# Altium schematic sheet BLDC-M8.SCHDOC: AVR-M16 无刷电调
size A4
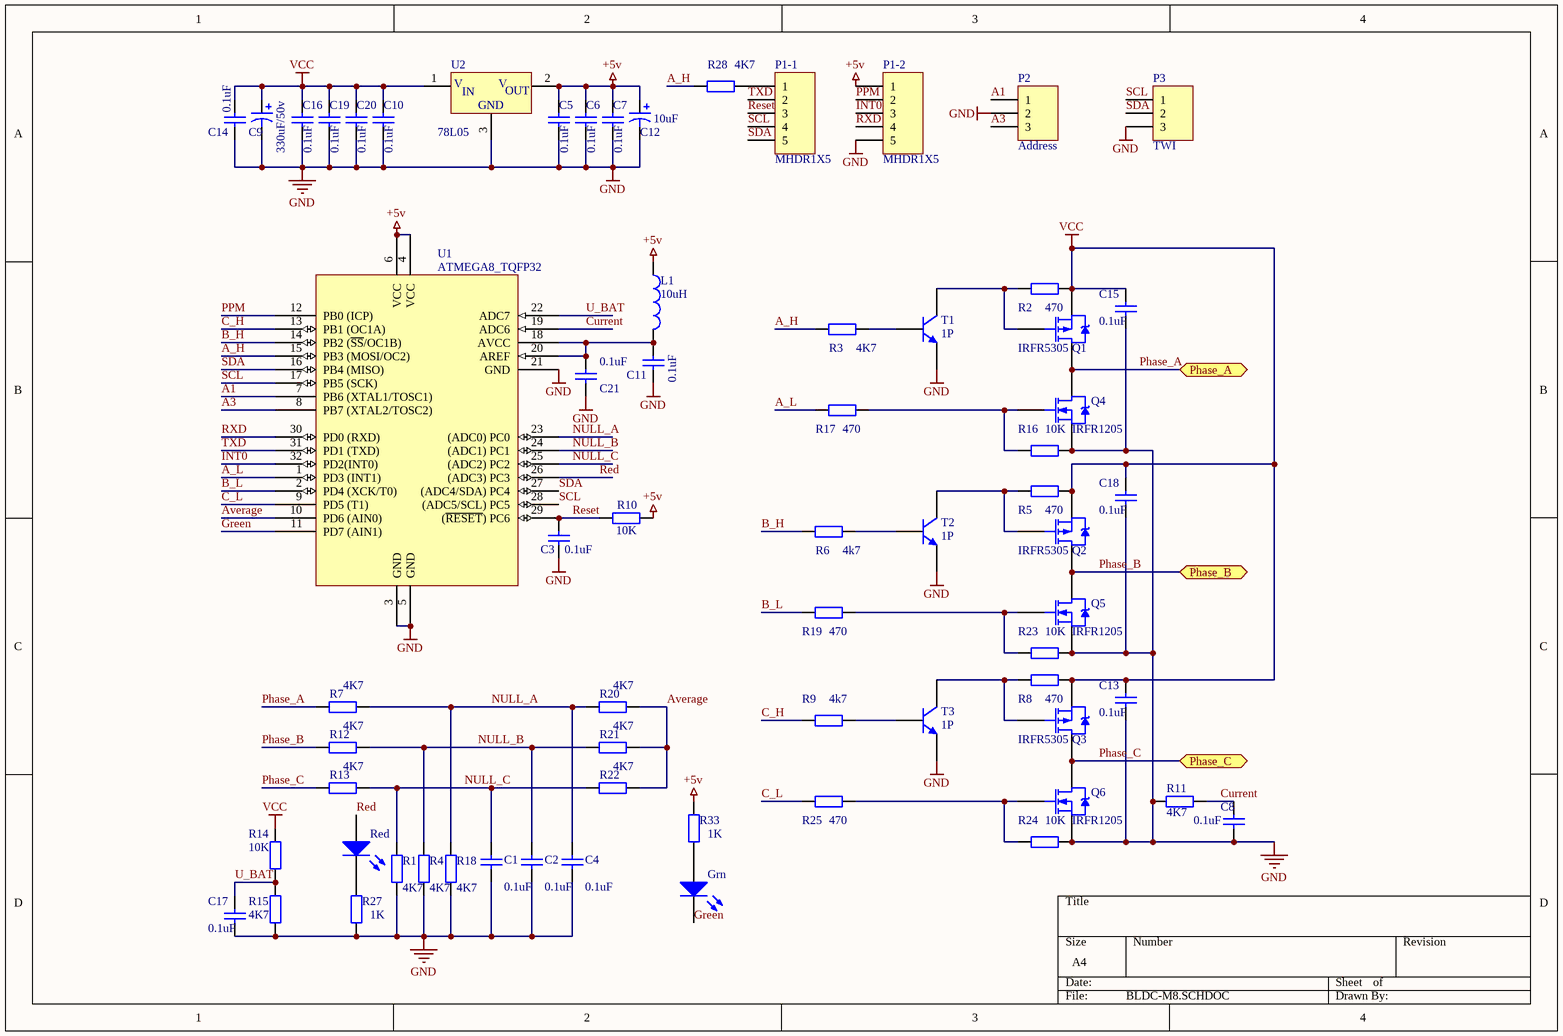
[diagram p0: BLDC-M8.SCHDOC]

## Parts
C1  value 0.1uF  [1608[0603]]  (hidden comment: Cap)
C2  value 0.1uF  [1608[0603]]  (hidden comment: Cap)
C3  value 0.1uF  [1608[0603]]  (hidden comment: Cap)
C4  value 0.1uF  [1608[0603]]  (hidden comment: Cap)
C5  value 0.1uF  [1608[0603]]  (hidden comment: Cap)
C6  value 0.1uF  [1608[0603]]  (hidden comment: Cap)
C7  value 0.1uF  [1608[0603]]  (hidden comment: Cap)
C8  value 0.1uF  [1608[0603]]  (hidden comment: Cap)
C9  value 330uF/50v  [RAD-0.2]  (hidden comment: Cap Pol1)
C10  value 0.1uF  [1608[0603]]  (hidden comment: Cap)
C11  value 0.1uF  [1608[0603]]  (hidden comment: Cap)
C12  value 10uF  [3216[1206]]  (hidden comment: Cap Pol1)
C13  value 0.1uF  [1608[0603]]  (hidden comment: Cap)
C14  value 0.1uF  [1608[0603]]  (hidden comment: Cap)
C15  value 0.1uF  [1608[0603]]  (hidden comment: Cap)
C16  value 0.1uF  [1608[0603]]  (hidden comment: Cap)
C17  value 0.1uF  [1608[0603]]  (hidden comment: Cap)
C18  value 0.1uF  [1608[0603]]  (hidden comment: Cap)
C19  value 0.1uF  [1608[0603]]  (hidden comment: Cap)
C20  value 0.1uF  [1608[0603]]  (hidden comment: Cap)
C21  value 0.1uF  [1608[0603]]  (hidden comment: Cap)
Grn  LED0  [1608[0603]]  (value not drawn)
L1  value 10uH  [0402-A]  (hidden comment: Inductor)
P1-1  MHDR1X5  [MHDR1X5]
P1-2  MHDR1X5  [MHDR1X5]
P2  Address  [HDR1X3]
P3  TWI  [HDR1X3]
Q1  IRFR5305  [TO-252AA]
Q2  IRFR5305  [SIP-G3/E8]
Q3  IRFR5305  [SIP-G3/E8]
Q4  IRFR1205  [SIP-G3/E8]
Q5  IRFR1205  [SIP-G3/E8]
Q6  IRFR1205  [SIP-G3/E8]
R1  value 4K7  [1608[0603]]  (hidden comment: Res2)
R2  value 470  [1608[0603]]  (hidden comment: Res2)
R3  value 4K7  [1608[0603]]  (hidden comment: Res2)
R4  value 4K7  [1608[0603]]  (hidden comment: Res2)
R5  value 470  [1608[0603]]  (hidden comment: Res2)
R6  value 4k7  [1608[0603]]  (hidden comment: Res2)
R7  value 4K7  [1608[0603]]  (hidden comment: Res2)
R8  value 470  [1608[0603]]  (hidden comment: Res2)
R9  value 4k7  [1608[0603]]  (hidden comment: Res2)
R10  value 10K  [1608[0603]]  (hidden comment: Res2)
R11  value 4K7  [1608[0603]]  (hidden comment: Res2)
R12  value 4K7  [1608[0603]]  (hidden comment: Res2)
R13  value 4K7  [1608[0603]]  (hidden comment: Res2)
R14  value 10K  [1608[0603]]  (hidden comment: Res2)
R15  value 4K7  [1608[0603]]  (hidden comment: Res2)
R16  value 10K  [1608[0603]]  (hidden comment: Res2)
R17  value 470  [1608[0603]]  (hidden comment: Res2)
R18  value 4K7  [1608[0603]]  (hidden comment: Res2)
R19  value 470  [1608[0603]]  (hidden comment: Res2)
R20  value 4K7  [1608[0603]]  (hidden comment: Res2)
R21  value 4K7  [1608[0603]]  (hidden comment: Res2)
R22  value 4K7  [1608[0603]]  (hidden comment: Res2)
R23  value 10K  [1608[0603]]  (hidden comment: Res2)
R24  value 10K  [1608[0603]]  (hidden comment: Res2)
R25  value 470  [1608[0603]]  (hidden comment: Res2)
R27  value 1K  [1608[0603]]  (hidden comment: Res2)
R28  value 4K7  [1608[0603]]  (hidden comment: Res2)
R33  value 1K  [1608[0603]]  (hidden comment: Res2)
Red  LED0  [1608[0603]]  (value not drawn)
T1  1P  [SOT-23]
T2  1P  [SOT-23]
T3  1P  [SOT-23]
U1  ATMEGA8_TQFP32  [LQFP32]
U2  78L05  [AMS1117]

## Ports
Phase_A (bidir), Phase_B (bidir), Phase_C (bidir)

## Nets
+5v: C5.1 C6.1 C7.1 C12.1 L1.1 P1-2.1 R10.2 R33.2 U1.4(VCC) U1.6(VCC) U2.2(VOUT)
GND: C1.1 C2.1 C3.2 C4.1 C5.2 C6.2 C7.2 C8.2 C9.2 C10.2 C11.2 C12.2 C13.1 C14.1 C15.1 C16.2 C17.2 C18.1 C19.2 C20.2 C21.2 P1-2.5 P2.2 P3.3 Q4.3(S) Q5.3(S) Q6.3(S) R1.1 R4.1 R11.2 R15.1 R16.2 R18.1 R23.2 R24.2 R27.1 T1.1(E) T2.1(E) T3.1(E) U1.3(GND) U1.5(GND) U1.21(GND) U2.3(GND)
VCC: C9.1 C10.1 C13.2 C14.2 C15.2 C16.1 C18.2 C19.1 C20.1 Q1.3(S) Q2.3(S) Q3.3(S) R2.2 R5.2 R8.2 R14.2 U2.1(VIN)
A1: P2.1 U1.7(PB6_(XTAL1/TOSC1))
A3: P2.3 U1.8(PB7_(XTAL2/TOSC2))
A_H: R3.1 R28.1 U1.15(PB3_(MOSI/OC2))
A_L: R17.1 U1.1(PD3_(INT1))
Average: R20.2 R21.2 R22.2 U1.10(PD6_(AIN0))
B_H: R6.1 U1.14(PB2_(~{SS}/OC1B))
B_L: R19.1 U1.2(PD4_(XCK/T0))
C_H: R9.1 U1.13(PB1_(OC1A))
C_L: R25.1 U1.9(PD5_(T1))
Current: C8.1 R11.1 U1.19(ADC6)
Green: Grn.2(K) U1.11(PD7_(AIN1))
INT0: P1-2.3 U1.32(PD2(INT0))
NULL_A: C4.2 R7.2 R18.2 R20.1 U1.23((ADC0)_PC0)
NULL_B: C2.2 R4.2 R12.2 R21.1 U1.24((ADC1)_PC1)
NULL_C: C1.2 R1.2 R13.2 R22.1 U1.25((ADC2)_PC2)
Phase_A: Q1.4(D) Q4.4(D) R7.1 ; port Phase_A
Phase_B: Q2.4(D) Q5.4(D) R12.1 ; port Phase_B
Phase_C: Q3.4(D) Q6.4(D) R13.1 ; port Phase_C
PPM: P1-2.2 U1.12(PB0_(ICP))
Red: Red.1(A) U1.26((ADC3)_PC3)
Reset: C3.1 P1-1.3 R10.1 U1.29((~{RESET})_PC6)
RXD: P1-2.4 U1.30(PD0_(RXD))
SCL: P1-1.4 P3.1 U1.17(PB5_(SCK)) U1.28((ADC5/SCL)_PC5)
SDA: P1-1.5 P3.2 U1.16(PB4_(MISO)) U1.27((ADC4/SDA)_PC4)
TXD: P1-1.2 U1.31(PD1_(TXD))
U_BAT: C17.1 R14.1 R15.2 U1.22(ADC7)
NetC11_1: C11.1 C21.1 L1.2 U1.18(AVCC) U1.20(AREF)
NetGrn_1: Grn.1(A) R33.1
NetP1-1_1: P1-1.1 R28.2
NetQ1_1: Q1.1(G) R2.1 T1.3(C)
NetQ2_1: Q2.1(G) R5.1 T2.3(C)
NetQ3_1: Q3.1(G) R8.1 T3.3(C)
NetQ4_1: Q4.1(G) R16.1 R17.2
NetQ5_1: Q5.1(G) R19.2 R23.1
NetQ6_1: Q6.1(G) R24.1 R25.2
NetR3_2: R3.2 T1.2(B)
NetR6_2: R6.2 T2.2(B)
NetR9_2: R9.2 T3.2(B)
NetR27_2: R27.2 Red.2(K)

## Notes on the sheet
- (in symbol 78L05) V; IN; OUT

## Library data of the parts
C1-C8 C10 C11 C13-C21 = Cap: Capacitor; Published: 8-Jun-2000; LatestRevisionDate: 17-Jul-2002; LatestRevisionNote: Re-released for DXP Platform.; PackageReference: RAD-0.3; Publisher: Altium Limited
C9 C12 = Cap Pol1: Polarized Capacitor (Radial); Published: 8-Jun-2000; LatestRevisionDate: 17-Jul-2002; LatestRevisionNote: Re-released for DXP Platform.; PackageReference: RB7.6-15; Publisher: Altium Limited
Grn Red = LED0: Typical INFRARED GaAs LED; Published: 8-Jun-2000; LatestRevisionDate: 08-Jul-2005; LatestRevisionNote: Mech Layer 1 removed.; PackageReference: LED-0; Publisher: Altium Limited
L1 = Inductor: Code_IEC: 1005; Published: 8-Jun-2000; LatestRevisionDate: 17-Jul-2002; LatestRevisionNote: Re-released for DXP Platform.; PackageReference: 0402-A; Publisher: Altium Limited; Code_JEITA: 0402
P1-1 P1-2 = MHDR1X5: Header, 5-Pin; LatestRevisionDate: 17-Jul-2002; LatestRevisionNote: Re-released for DXP Platform.; Publisher: Altium Limited
P2 P3 = Header 3: Header, 3-Pin; LatestRevisionDate: 17-Jul-2002; LatestRevisionNote: Re-released for DXP Platform.; Publisher: Altium Limited
Q1-Q3 = IRFR5305: HEXFET Power MOSFET; Manufacturer: International Rectifier; Class I: Discrete; Class II: MOSFET - Power; Note: Pin 2 is trimmed and is electrically connected to Drain.; Published: 8-Jun-2000; Revision: July-2002: Re-released for DXP Platform.; Datasheet: Latest Revision: PD-9.1402; Package Reference: TO-252AA; Publisher: Altium Limited
Q4-Q6 = IRFR1205: HEXFET Power MOSFET; Manufacturer: International Rectifier; Class I: Discrete; Class II: MOSFET - Power; Note: Pin 2 is trimmed and is electrically connected to Drain.; Published: 8-Jun-2000; Revision: July-2002: Re-released for DXP Platform.; Datasheet: Latest Revision: PD-91318B; Package Reference: TO-252AA; Publisher: Altium Limited
R1-R25 R27 R28 R33 = Res2: Resistor; Published: 8-Jun-2000; LatestRevisionDate: 17-Jul-2002; LatestRevisionNote: Re-released for DXP Platform.; PackageReference: 1608[0603]; Publisher: Altium Limited
T1-T3 = 2N3904: NPN General Purpose Amplifier; Published: 8-Jun-2000; LatestRevisionDate: 15-Jan-2003; LatestRevisionNote: PCB Footprint 'BCY-W3/D4.7' replaced; PackageReference: TO-92A; Publisher: Altium Limited; Code_JEDEC: TO-92A; DatasheetDocument: 1997; PackageDocument: Sep-1998; ComponentLink1Description: Manufacturer Link; ComponentLink1URL: http://www.fairchildsemi.com/; ComponentLink2Description: Datasheet; ComponentLink2URL: http://www.fairchildsemi.com/ds/2N%2F2N3904.pdf
U1 = ATMEGA8_TQFP32: Atmel Microcontroller - Library created by carel..  <www.mpfreezone.com>
U2 = 78L05: 3-Terminal Positive Voltage Regulator